# EasyEDA Pro project miniMQ.epro, schematic Wing
Board Name: Wing; Create Date: 2026-09-22; Page Name: P1; Project Name: MagicQ Compact Mini Connect; Schematic Name: Wing; Update Date: 2026-09-22; Company: EasyEDA.com; Page Size: A4; Version: V1.0
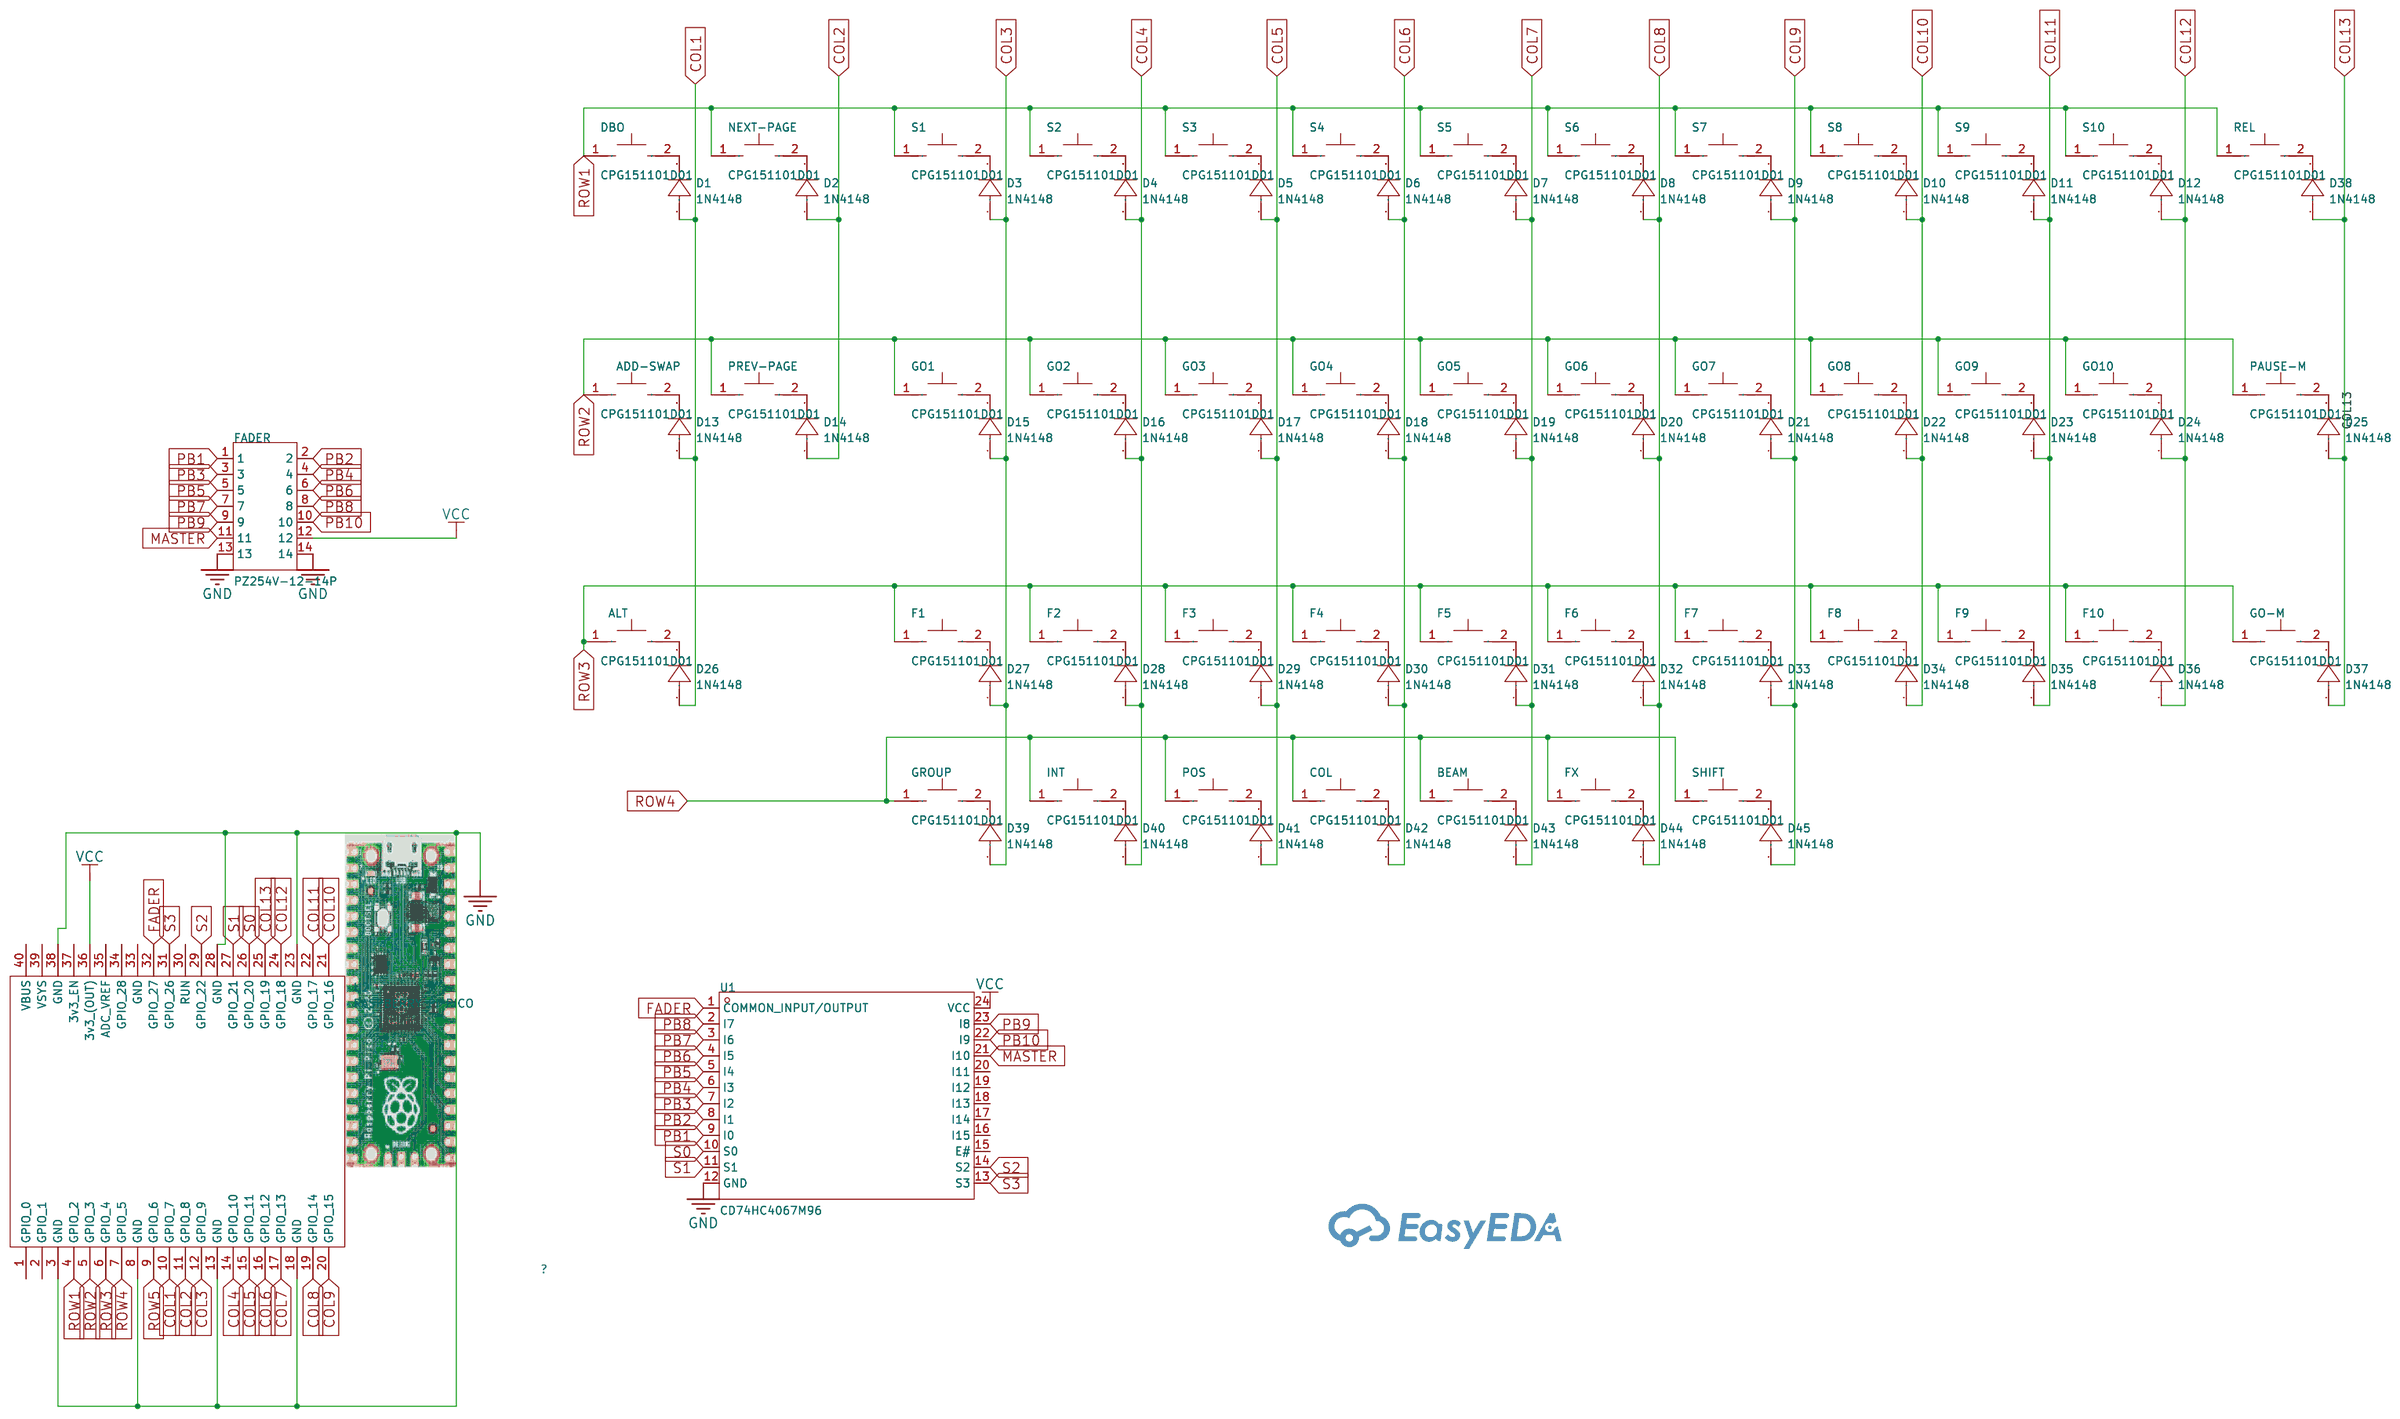
[diagram p7: schematic sheet]

## Parts
ADD-SWAP  CPG151101D01  [SW-TH_CPG151101D9X]
ALT  CPG151101D01  [SW-TH_CPG151101D9X]
BEAM  CPG151101D01  [SW-TH_CPG151101D9X]
COL  CPG151101D01  [SW-TH_CPG151101D9X]
D1  1N4148  [DO-35_BD2.2-L4.0-D0.50_1N4148]
D2  1N4148  [DO-35_BD2.2-L4.0-D0.50_1N4148]
D3  1N4148  [DO-35_BD2.2-L4.0-D0.50_1N4148]
D4  1N4148  [DO-35_BD2.2-L4.0-D0.50_1N4148]
D5  1N4148  [DO-35_BD2.2-L4.0-D0.50_1N4148]
D6  1N4148  [DO-35_BD2.2-L4.0-D0.50_1N4148]
D7  1N4148  [DO-35_BD2.2-L4.0-D0.50_1N4148]
D8  1N4148  [DO-35_BD2.2-L4.0-D0.50_1N4148]
D9  1N4148  [DO-35_BD2.2-L4.0-D0.50_1N4148]
D10  1N4148  [DO-35_BD2.2-L4.0-D0.50_1N4148]
D11  1N4148  [DO-35_BD2.2-L4.0-D0.50_1N4148]
D12  1N4148  [DO-35_BD2.2-L4.0-D0.50_1N4148]
D13  1N4148  [DO-35_BD2.2-L4.0-D0.50_1N4148]
D14  1N4148  [DO-35_BD2.2-L4.0-D0.50_1N4148]
D15  1N4148  [DO-35_BD2.2-L4.0-D0.50_1N4148]
D16  1N4148  [DO-35_BD2.2-L4.0-D0.50_1N4148]
D17  1N4148  [DO-35_BD2.2-L4.0-D0.50_1N4148]
D18  1N4148  [DO-35_BD2.2-L4.0-D0.50_1N4148]
D19  1N4148  [DO-35_BD2.2-L4.0-D0.50_1N4148]
D20  1N4148  [DO-35_BD2.2-L4.0-D0.50_1N4148]
D21  1N4148  [DO-35_BD2.2-L4.0-D0.50_1N4148]
D22  1N4148  [DO-35_BD2.2-L4.0-D0.50_1N4148]
D23  1N4148  [DO-35_BD2.2-L4.0-D0.50_1N4148]
D24  1N4148  [DO-35_BD2.2-L4.0-D0.50_1N4148]
D25  1N4148  [DO-35_BD2.2-L4.0-D0.50_1N4148]
D26  1N4148  [DO-35_BD2.2-L4.0-D0.50_1N4148]
D27  1N4148  [DO-35_BD2.2-L4.0-D0.50_1N4148]
D28  1N4148  [DO-35_BD2.2-L4.0-D0.50_1N4148]
D29  1N4148  [DO-35_BD2.2-L4.0-D0.50_1N4148]
D30  1N4148  [DO-35_BD2.2-L4.0-D0.50_1N4148]
D31  1N4148  [DO-35_BD2.2-L4.0-D0.50_1N4148]
D32  1N4148  [DO-35_BD2.2-L4.0-D0.50_1N4148]
D33  1N4148  [DO-35_BD2.2-L4.0-D0.50_1N4148]
D34  1N4148  [DO-35_BD2.2-L4.0-D0.50_1N4148]
D35  1N4148  [DO-35_BD2.2-L4.0-D0.50_1N4148]
D36  1N4148  [DO-35_BD2.2-L4.0-D0.50_1N4148]
D37  1N4148  [DO-35_BD2.2-L4.0-D0.50_1N4148]
D38  1N4148  [DO-35_BD2.2-L4.0-D0.50_1N4148]
D39  1N4148  [DO-35_BD2.2-L4.0-D0.50_1N4148]
D40  1N4148  [DO-35_BD2.2-L4.0-D0.50_1N4148]
D41  1N4148  [DO-35_BD2.2-L4.0-D0.50_1N4148]
D42  1N4148  [DO-35_BD2.2-L4.0-D0.50_1N4148]
D43  1N4148  [DO-35_BD2.2-L4.0-D0.50_1N4148]
D44  1N4148  [DO-35_BD2.2-L4.0-D0.50_1N4148]
D45  1N4148  [DO-35_BD2.2-L4.0-D0.50_1N4148]
DBO  CPG151101D01  [SW-TH_CPG151101D9X]
F1  CPG151101D01  [SW-TH_CPG151101D9X]
F2  CPG151101D01  [SW-TH_CPG151101D9X]
F3  CPG151101D01  [SW-TH_CPG151101D9X]
F4  CPG151101D01  [SW-TH_CPG151101D9X]
F5  CPG151101D01  [SW-TH_CPG151101D9X]
F6  CPG151101D01  [SW-TH_CPG151101D9X]
F7  CPG151101D01  [SW-TH_CPG151101D9X]
F8  CPG151101D01  [SW-TH_CPG151101D9X]
F9  CPG151101D01  [SW-TH_CPG151101D9X]
F10  CPG151101D01  [SW-TH_CPG151101D9X]
FADER  PZ254V-12-14P  [HDR-TH_14P-P2.54-V-M-R2-C7-S2.54]
FX  CPG151101D01  [SW-TH_CPG151101D9X]
GO1  CPG151101D01  [SW-TH_CPG151101D9X]
GO2  CPG151101D01  [SW-TH_CPG151101D9X]
GO3  CPG151101D01  [SW-TH_CPG151101D9X]
GO4  CPG151101D01  [SW-TH_CPG151101D9X]
GO5  CPG151101D01  [SW-TH_CPG151101D9X]
GO6  CPG151101D01  [SW-TH_CPG151101D9X]
GO7  CPG151101D01  [SW-TH_CPG151101D9X]
GO8  CPG151101D01  [SW-TH_CPG151101D9X]
GO9  CPG151101D01  [SW-TH_CPG151101D9X]
GO10  CPG151101D01  [SW-TH_CPG151101D9X]
GO-M  CPG151101D01  [SW-TH_CPG151101D9X]
GROUP  CPG151101D01  [SW-TH_CPG151101D9X]
INT  CPG151101D01  [SW-TH_CPG151101D9X]
NEXT-PAGE  CPG151101D01  [SW-TH_CPG151101D9X]
PAUSE-M  CPG151101D01  [SW-TH_CPG151101D9X]
POS  CPG151101D01  [SW-TH_CPG151101D9X]
PREV-PAGE  CPG151101D01  [SW-TH_CPG151101D9X]
REL  CPG151101D01  [SW-TH_CPG151101D9X]
S1  CPG151101D01  [SW-TH_CPG151101D9X]
S2  CPG151101D01  [SW-TH_CPG151101D9X]
S3  CPG151101D01  [SW-TH_CPG151101D9X]
S4  CPG151101D01  [SW-TH_CPG151101D9X]
S5  CPG151101D01  [SW-TH_CPG151101D9X]
S6  CPG151101D01  [SW-TH_CPG151101D9X]
S7  CPG151101D01  [SW-TH_CPG151101D9X]
S8  CPG151101D01  [SW-TH_CPG151101D9X]
S9  CPG151101D01  [SW-TH_CPG151101D9X]
S10  CPG151101D01  [SW-TH_CPG151101D9X]
SHIFT  CPG151101D01  [SW-TH_CPG151101D9X]
U1  CD74HC4067M96  [SOIC-24_L15.4-W7.5-P1.27-LS10.3-BL]
U2  RASPBERRY PI PICO  [footprint_dab4]

## Library data of the parts
ADD-SWAP ALT BEAM COL DBO F1-F10 FX GO1-GO10 GO-M GROUP INT NEXT-PAGE PAUSE-M POS PREV-PAGE REL S1-S10 SHIFT = CPG151101D01: Axis Type:Black Switch Operation Force:60gf Conduction Travel:2mm Voltage Rating:12V Operating Temperature:-40℃~+70℃ Operating Temperature:-40℃~+70℃; LCSC Part Name: 黑轴; Supplier Part: C49234238; Manufacturer: HanElectricity(瀚源); Supplier Footprint: 插件; JLCPCB Part Class: Extended Part; Datasheet: https://item.szlcsc.com/datasheet/CPG151101D01/51650380.html; Supplier: LCSC; Axis Type: Black Switch; Operation Force: 60gf; Conduction Travel: 2mm; Voltage Rating: 12V; Operating Temperature: -40℃~+70℃
D1-D45 = 1N4148_C18195411: Diode Configuration:1 Independent Pd - Power Dissipation:500mW Current - Rectified:150mA Voltage - DC Reverse(Vr):100V Voltage - Forward(Vf@If):1V@10mA Non-Repetitive Peak Forward Surge Current:500mA Reverse Leakage Current (Ir):5mA Reverse Recovery Time; LCSC Part Name: 100V 150mA; Supplier Part: C18195411; Manufacturer: LJ(朗捷); Supplier Footprint: DO-35; JLCPCB Part Class: Extended Part; Datasheet: https://item.szlcsc.com/datasheet/1N4148/19344798.html; Supplier: LCSC; Diode Configuration: 1 Independent; Pd - Power Dissipation: 500mW; Current - Rectified: 150mA; Voltage - DC Reverse(Vr): 100V; Voltage - Forward(Vf@If): 1V@10mA; Non-Repetitive Peak Forward Surge Current: 500mA; Reverse Leakage Current (Ir): 5mA; Reverse Recovery Time (trr): 4ns; Operating Junction Temperature Range: -60℃~+200℃
FADER = PZ254V-12-14P: Pin Structure:2x7P Pitch:2.54mm Row Spacing:2.54mm Circluar Pins/Square Pins:Pin Header Mounting Type:Through Hole Number of Rows:2 Number of Pins:14P Current Rating:- Voltage Rating (Max):- Length of Mating Pin:6mm Insulation Height:2.5mm Length of End C; LCSC Part Name: 2x7P 间距:2.54mm 方针 直插; Supplier Part: C492424; Manufacturer: XFCN(兴飞); Supplier Footprint: 插件,P=2.54mm; JLCPCB Part Class: Extended Part; Datasheet: https://item.szlcsc.com/datasheet/PZ254V-12-14P/502980.html; Supplier: LCSC; Pin Structure: 2x7P; Pitch: 2.54mm; Row Spacing: 2.54mm; Circluar Pins/Square Pins: Pin Header; Mounting Type: Through Hole; Number of Rows: 2; Number of Pins: 14P; Length of Mating Pin: 6mm; Insulation Height: 2.5mm; Length of End Connection Pin: 3mm; Contact Material: Brass; Operating Temperature: -40℃~+105℃; Color: Black
U1 = CD74HC4067M96: Switch Circuit:16:1 Number of Channels:16 Ron:70Ω Voltage - Supply:2V~6V Voltage - Supply:2V~6V Con:- Turn-on time:83ns Turn-off time:83ns Bandwidth:89MHz Operating Temperature:-55℃~+125℃ Operating Temperature:-55℃~+125℃ Propagation Delay (tpd):15ns Featu; LCSC Part Name: 高速CMOS逻辑16通道模拟多路复用器/解复用器; Supplier Part: C496123; Manufacturer: TI(德州仪器); Supplier Footprint: SOIC-24-300mil; JLCPCB Part Class: Extended Part; Datasheet: https://www.ti.com/cn/lit/gpn/cd74hc4067; Supplier: LCSC; Switch Circuit: 16:1; Number of Channels: 16; Ron: 70Ω; Voltage - Supply: 2V~6V; Turn-on time: 83ns; Turn-off time: 83ns; Bandwidth: 89MHz; Operating Temperature: -55℃~+125℃; Propagation Delay (tpd): 15ns; Features: Bidirectional analog channel
U2 = RASPBERRY PI PICO

## Nets
GND: FADER.13 FADER.14 U1.12(GND) U2.3(GND) U2.8(GND) U2.13(GND) U2.18(GND) U2.23(GND) U2.28(GND) U2.38(GND)
VCC: FADER.12 U1.24(VCC) U2.36(3v3 (OUT))
COL1: D1.1(A) D13.1(A) D26.1(A) U2.10(GPIO 7)
COL2: D2.1(A) D14.1(A) U2.11(GPIO 8)
COL3: D3.1(A) D15.1(A) D27.1(A) D39.1(A) U2.12(GPIO 9)
COL4: D4.1(A) D16.1(A) D28.1(A) D40.1(A) U2.14(GPIO 10)
COL5: D5.1(A) D17.1(A) D29.1(A) D41.1(A) U2.15(GPIO 11)
COL6: D6.1(A) D18.1(A) D30.1(A) D42.1(A) U2.16(GPIO 12)
COL7: D7.1(A) D19.1(A) D31.1(A) D43.1(A) U2.17(GPIO 13)
COL8: D8.1(A) D20.1(A) D32.1(A) D44.1(A) U2.19(GPIO 14)
COL9: D9.1(A) D21.1(A) D33.1(A) D45.1(A) U2.20(GPIO 15)
COL10: D10.1(A) D22.1(A) D34.1(A) U2.21(GPIO 16)
COL11: D11.1(A) D23.1(A) D35.1(A) U2.22(GPIO 17)
COL12: D12.1(A) D24.1(A) D36.1(A) U2.24(GPIO 18)
COL13: D25.1(A) D37.1(A) D38.1(A) U2.25(GPIO 19)
FADER: U1.1(COMMON INPUT/OUTPUT) U2.32(GPIO 27)
MASTER: FADER.11 U1.21(I10)
PB1: FADER.1 U1.9(I0)
PB2: FADER.2 U1.8(I1)
PB3: FADER.3 U1.7(I2)
PB4: FADER.4 U1.6(I3)
PB5: FADER.5 U1.5(I4)
PB6: FADER.6 U1.4(I5)
PB7: FADER.7 U1.3(I6)
PB8: FADER.8 U1.2(I7)
PB9: FADER.9 U1.23(I8)
PB10: FADER.10 U1.22(I9)
ROW1: DBO.1 NEXT-PAGE.1 REL.1 S1.1 S2.1 S3.1 S4.1 S5.1 S6.1 S7.1 S8.1 S9.1 S10.1 U2.4(GPIO 2)
ROW2: ADD-SWAP.1 GO1.1 GO2.1 GO3.1 GO4.1 GO5.1 GO6.1 GO7.1 GO8.1 GO9.1 GO10.1 PAUSE-M.1 PREV-PAGE.1 U2.5(GPIO 3)
ROW3: ALT.1 F1.1 F2.1 F3.1 F4.1 F5.1 F6.1 F7.1 F8.1 F9.1 F10.1 GO-M.1 U2.6(GPIO 4)
ROW4: BEAM.1 COL.1 FX.1 GROUP.1 INT.1 POS.1 SHIFT.1 U2.7(GPIO 5)
ROW5: U2.9(GPIO 6)
S0: U1.10(S0) U2.26(GPIO 20)
S1: U1.11(S1) U2.27(GPIO 21)
S2: U1.14(S2) U2.29(GPIO 22)
S3: U1.13(S3) U2.31(GPIO 26)
$1N3745: D3.2(C) S1.2
$1N3746: D4.2(C) S2.2
$1N3747: D5.2(C) S3.2
$1N3748: D6.2(C) S4.2
$1N3749: D7.2(C) S5.2
$1N3750: D8.2(C) S6.2
$1N3751: D9.2(C) S7.2
$1N3752: D10.2(C) S8.2
$1N3753: D11.2(C) S9.2
$1N3754: D12.2(C) S10.2
$1N3755: ADD-SWAP.2 D13.2(C)
$1N3756: D14.2(C) PREV-PAGE.2
$1N3757: D15.2(C) GO1.2
$1N3758: D16.2(C) GO2.2
$1N3759: D17.2(C) GO3.2
$1N3760: D18.2(C) GO4.2
$1N3761: D19.2(C) GO5.2
$1N3762: D20.2(C) GO6.2
$1N3763: D21.2(C) GO7.2
$1N3764: D22.2(C) GO8.2
$1N3765: D23.2(C) GO9.2
$1N3766: D24.2(C) GO10.2
$1N3767: D25.2(C) PAUSE-M.2
$1N3768: ALT.2 D26.2(C)
$1N3769: D27.2(C) F1.2
$1N3770: D28.2(C) F2.2
$1N3771: D29.2(C) F3.2
$1N3772: D30.2(C) F4.2
$1N3773: D31.2(C) F5.2
$1N3774: D32.2(C) F6.2
$1N3775: D33.2(C) F7.2
$1N3776: D34.2(C) F8.2
$1N3777: D35.2(C) F9.2
$1N3778: D36.2(C) F10.2
$1N3779: D37.2(C) GO-M.2
$1N3817: D1.2(C) DBO.2
$1N3818: D2.2(C) NEXT-PAGE.2
$1N3819: D38.2(C) REL.2
$1N5184: D39.2(C) GROUP.2
$1N5225: D40.2(C) INT.2
$1N5266: D41.2(C) POS.2
$1N5307: COL.2 D42.2(C)
$1N5348: BEAM.2 D43.2(C)
$1N5389: D44.2(C) FX.2
$1N5430: D45.2(C) SHIFT.2

Not connected (* = marked no-connect by the designer): U1 15(E#) 16(I15) 17(I14) 18(I13) 19(I12) 20(I11); U2 1(GPIO 0) 2(GPIO 1) 30(RUN) 33(GND) 34(GPIO 28) 35(ADC_VREF) 37(3v3_EN) 39(VSYS) 40(VBUS)
